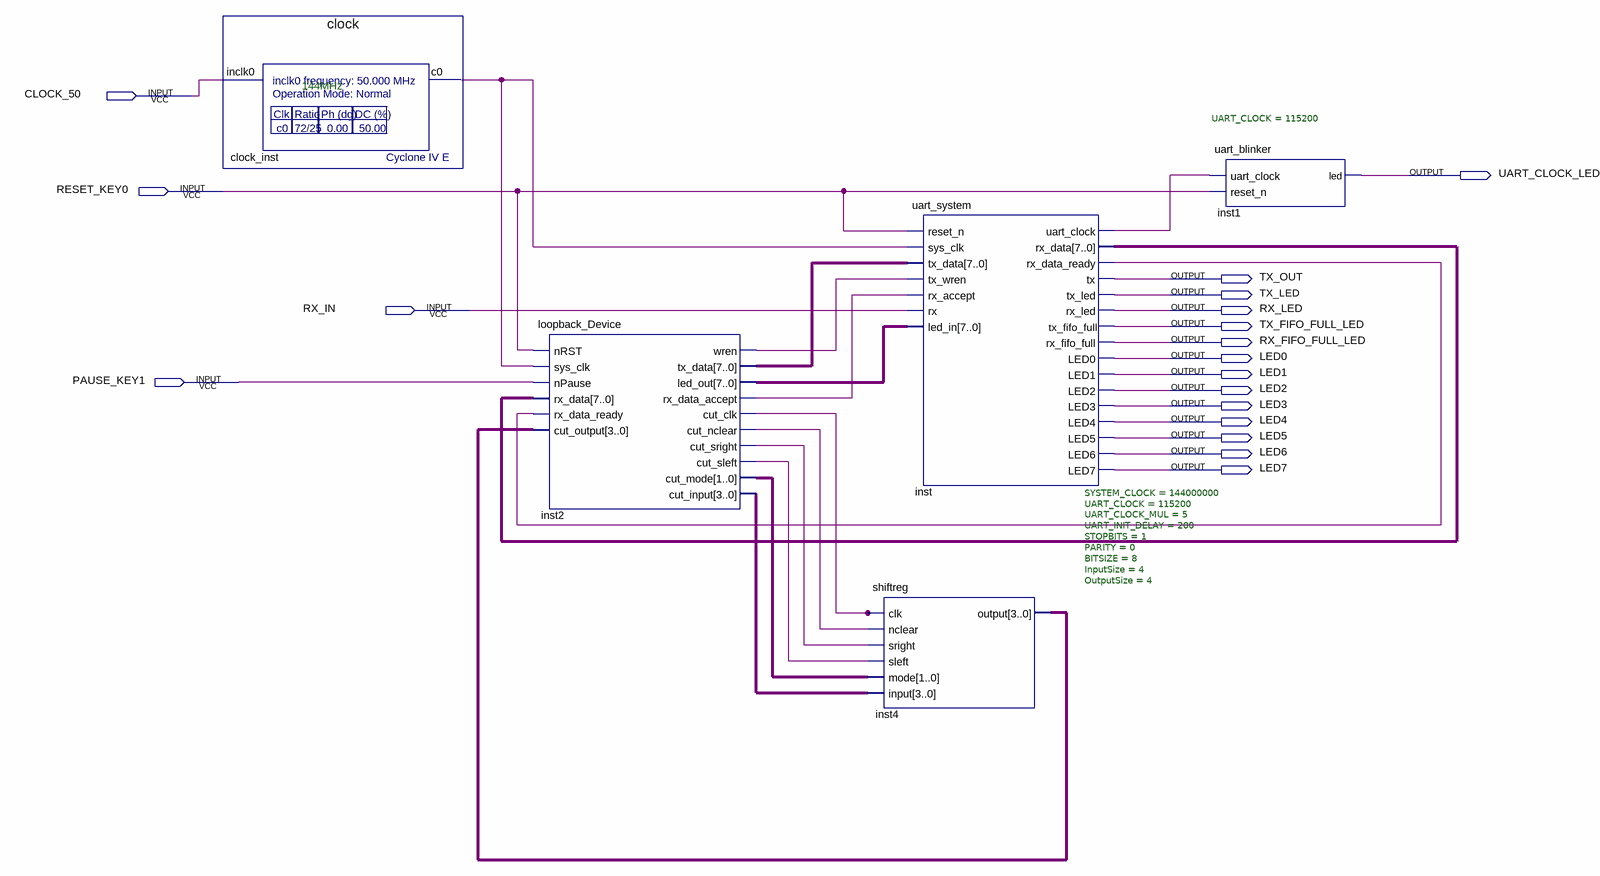
[diagram p0: schematic sheet]
// Quartus schematic loopback_test.bdf as structural Verilog: 5 symbols, 18 pins
module loopback_test (
  input  CLOCK_50,
  input  RESET_KEY0,
  input  RX_IN,
  input  PAUSE_KEY1,
  output UART_CLOCK_LED,
  output TX_OUT,
  output TX_LED,
  output RX_LED,
  output TX_FIFO_FULL_LED,
  output RX_FIFO_FULL_LED,
  output LED0,
  output LED1,
  output LED2,
  output LED3,
  output LED4,
  output LED5,
  output LED6,
  output LED7
);

  wire clock_inst_c0, inst2_cut_clk, inst2_cut_nclear, inst2_cut_sleft, inst2_cut_sright,
       inst2_rx_data_accept, inst2_wren, inst_rx_data_ready, inst_uart_clock;
  wire [1:0] inst2_cut_mode;
  wire [3:0] inst2_cut_input, inst4_output;
  wire [7:0] inst2_led_out, inst2_tx_data, inst_rx_data;

  clock clock_inst (.inclk0(CLOCK_50), .c0(clock_inst_c0));
  loopback_Device inst2 (
    .nRST(RESET_KEY0), .sys_clk(clock_inst_c0), .nPause(PAUSE_KEY1), .rx_data(inst_rx_data),
    .rx_data_ready(inst_rx_data_ready), .cut_output(inst4_output), .wren(inst2_wren),
    .tx_data(inst2_tx_data), .led_out(inst2_led_out), .rx_data_accept(inst2_rx_data_accept),
    .cut_clk(inst2_cut_clk), .cut_nclear(inst2_cut_nclear), .cut_sright(inst2_cut_sright),
    .cut_sleft(inst2_cut_sleft), .cut_mode(inst2_cut_mode), .cut_input(inst2_cut_input));
  shiftreg inst4 (
    .clk(inst2_cut_clk), .nclear(inst2_cut_nclear), .sright(inst2_cut_sright), .sleft(inst2_cut_sleft),
    .mode(inst2_cut_mode), .\input (inst2_cut_input), .\output (inst4_output));
  uart_system #(.SYSTEM_CLOCK(144000000), .UART_CLOCK(115200), .UART_CLOCK_MUL(5), .UART_INIT_DELAY(200), .STOPBITS(1), .PARITY(0), .BITSIZE(8), .InputSize(4), .OutputSize(4)) inst (
    .reset_n(RESET_KEY0), .sys_clk(clock_inst_c0), .tx_data(inst2_tx_data), .tx_wren(inst2_wren),
    .rx_accept(inst2_rx_data_accept), .rx(RX_IN), .led_in(inst2_led_out), .uart_clock(inst_uart_clock),
    .rx_data(inst_rx_data), .rx_data_ready(inst_rx_data_ready), .tx(TX_OUT), .tx_led(TX_LED),
    .rx_led(RX_LED), .tx_fifo_full(TX_FIFO_FULL_LED), .rx_fifo_full(RX_FIFO_FULL_LED), .LED0(LED0),
    .LED1(LED1), .LED2(LED2), .LED3(LED3), .LED4(LED4), .LED5(LED5), .LED6(LED6), .LED7(LED7));
  uart_blinker #(.UART_CLOCK(115200)) inst1 (.uart_clock(inst_uart_clock), .reset_n(RESET_KEY0), .led(UART_CLOCK_LED));

  // Notes on the sheet:
  //   144MHz
endmodule
